# EAGLE design TLC5973 (EAGLE 6.5.0)
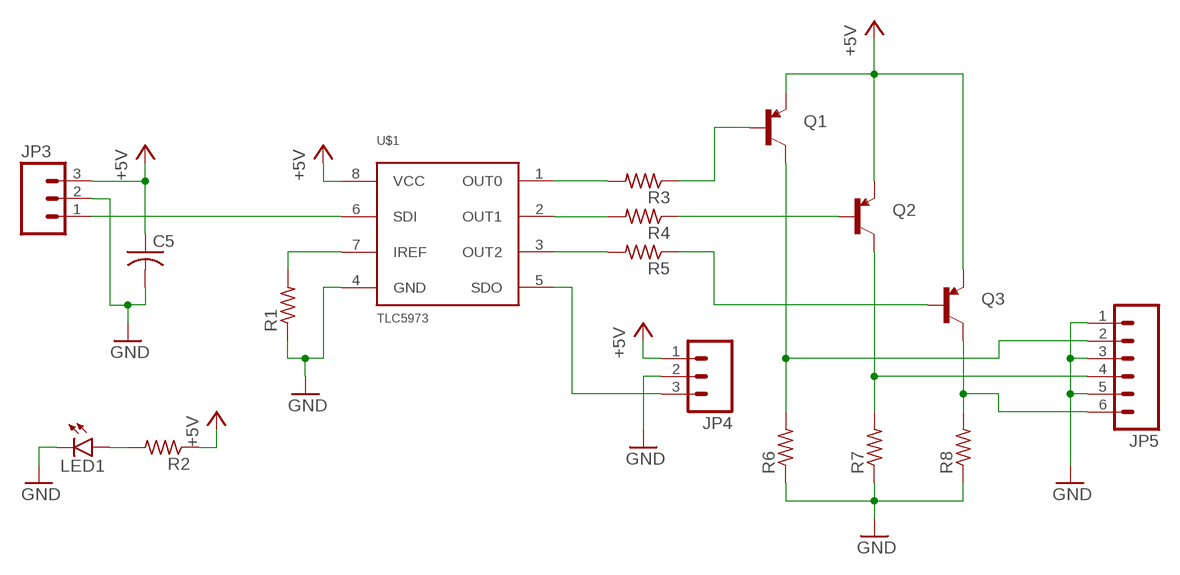
[diagram p0: schematic, sheet 1]

## Parts
C5  C-USC0805K  [C0805K]
JP3  M03LOCK  [1X03_LOCK]
JP4  M03LOCK  [1X03_LOCK]
JP5  M06LOCK  [1X06_LOCK]
LED1  LED1206  [LED-1206]
Q1  TRANSISTOR_PNPSMD  [SOT23-3]
Q2  TRANSISTOR_PNPSMD  [SOT23-3]
Q3  TRANSISTOR_PNPSMD  [SOT23-3]
R1  R-US_R0805  [R0805]
R2  R-US_R0805  [R0805]
R3  R-US_R0805  [R0805]
R4  R-US_R0805  [R0805]
R5  R-US_R0805  [R0805]
R6  R-US_R0805  [R0805]
R7  R-US_R0805  [R0805]
R8  R-US_R0805  [R0805]
U$1  TLC5973  [SO-08]

## Nets
+5V: C5.1 JP3.3 JP4.1 Q1.2(E) Q2.2(E) Q3.2(E) R2.1 U$1.8(VCC)
GND: C5.2 JP3.2 JP4.2 JP5.1 JP5.3 JP5.5 LED1.C R1.1 R6.1 R7.1 R8.1 U$1.4(GND)
N$1: R1.2 U$1.7(IREF)
N$2: JP3.1 U$1.6(SDI)
N$3: Q2.1(B) R4.1
N$4: Q1.1(B) R3.1
N$5: Q3.1(B) R5.1
N$6: JP4.3 U$1.5(SDO)
N$7: LED1.A R2.2
N$8: JP5.2 Q1.3(C) R6.2
N$10: R3.2 U$1.1(OUT0)
N$11: R4.2 U$1.2(OUT1)
N$12: R5.2 U$1.3(OUT2)
N$13: JP5.4 Q2.3(C) R7.2
N$14: JP5.6 Q3.3(C) R8.2

## Library data of the parts
C5 = rcl:C-US: CAPACITOR, American symbol
JP3 JP4 = SparkFun-Connectors:M03: Header 3 Standard 3-pin 0.1" header. Use with straight break away headers (SKU : PRT-00116), right angle break away headers (PRT-00553), swiss pins (PRT-00743), machine pins (PRT-00117), and female headers (PRT-00115). Molex polarized connector foot print use with SKU : PRT-08232 with associated crimp pins and housings.
JP5 = SparkFun-Connectors:M06: Header 6 Standard 6-pin 0.1" header. Use with straight break away headers (SKU : PRT-00116), right angle break away headers (PRT-00553), swiss pins (PRT-00743), machine pins (PRT-00117), and female headers (PRT-00115). Molex polarized connector foot print use with SKU : PRT-08094 with associated crimp pins and housings. NOTES ON THE VARIANTS LOCK and LOCK_LONGPADS... This footprint was designed to help hold the alignment of a through-hole component (i.e. 6-pin header) while soldering it into place. You may notice that each hole has been shifted either up or down by 0.005 of an inch from it's more standard position (which is a perfectly straight line). This slight alteration caused the pins (the squares in the middle) to touch the edges of the holes. Because they are alternating, it causes a "brace" to hold the component in place. 0.005 has proven to be the perfect amount of "off-center" position when using our standard breakaway headers. Although looks a little odd when you look at the bare footprint, once you have a header in there, the alteration is very hard to notice. Also,if you push a header all the way into place, it is covered up entirely on the bottom side. This idea of altering the position of holes to aid alignment will be further integrated into the Sparkfun Library for other footprints. It can help hold any component with 3 or more connection pins.
LED1 = SparkFun-LED:LED: LEDs Standard schematic elements and footprints for 5mm, 3mm, 1206, and 0603 sized LEDs. 5mm - Spark Fun Electronics SKU : COM-00529 (and others)
Q1-Q3 = SparkFun-DiscreteSemi:TRANSISTOR_PNP: Generic PNP BJT Double check pinouts against datasheets- not all devices are the same! MMBT3906 - 40V 200mA SOT-23 (TRANS-08052) MMBT4403 - 40V 600mA SOT-23 (TRANS-09245)
R1-R8 = rcl:R-US_: RESISTOR, American symbol
U$1 = texas:TLC5973: TLC5973 3-channel 12-bit PWM LED driver. 2-50mA, internal 12MHz GS clock, 2.9KHz PWM frequency. SOIC-8 package

## Board
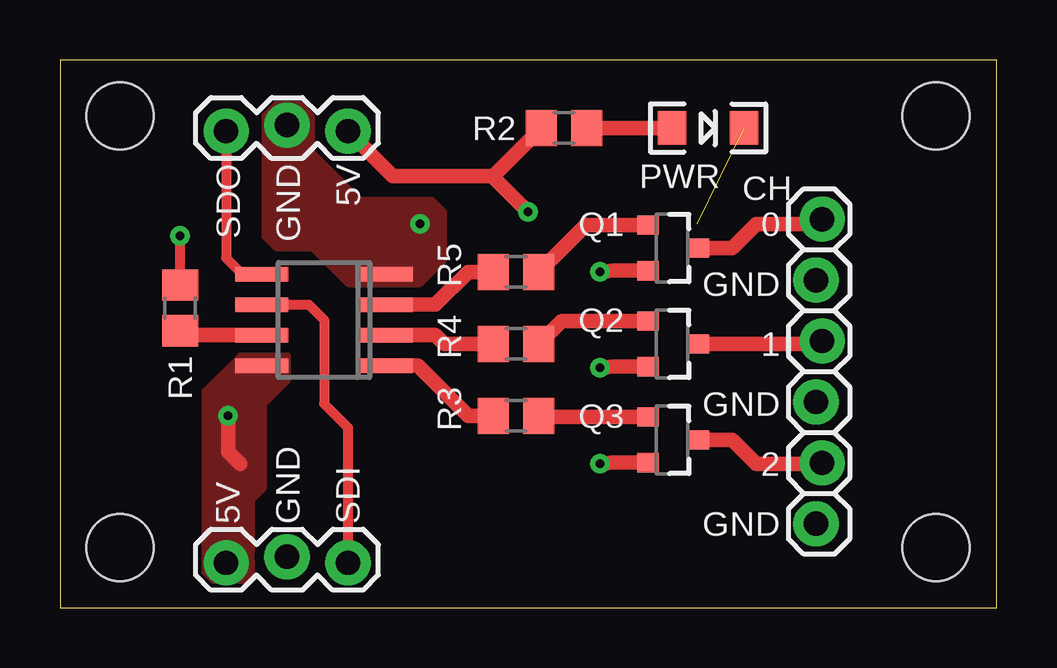
[diagram p1: board, top side]
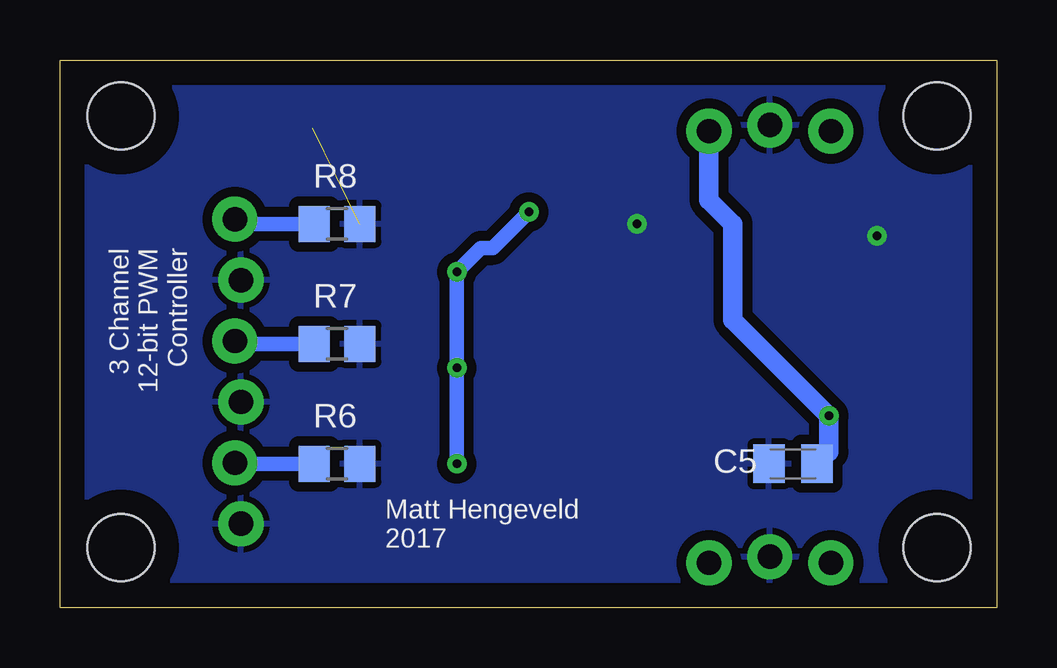
[diagram p2: board, bottom side, seen from below]

Size 39.04 x 22.84 mm. Coordinates in mm from the lower left corner, seen from the top.
Outline: 0,0 39.04,0 39.04,22.84 0,22.84 0,0
Copper layers (1*16): Top 0.035mm / dielectric 1.5mm / Bottom 0.035mm
Design rules "default": minimum track width 10mil, minimum drill 24mil, track to track 8mil, track to pad 8mil, pad to pad 8mil, via to via 8mil, smd to smd 8mil, copper to edge 40mil, drill to drill 8mil, minimum pad ring 10mil, minimum via ring 8mil, stop-mask expansion 4mil, vias tented up to drill 0mil, thermal gap 10mil
Holes 2.8 mm at 2.5,20.5 2.5,2.5 36.5,2.5 36.5,20.5

### Footprints (pad centres in the part's own frame; a part is rotated, then mirrored left to right if it is on the bottom)
C0805K = smd 1.3 x 1.6: 1 -1,0; 2 1,0
1X03_LOCK = drill 1.016 pad 1.88: 1 0,0.127; 2 2.54,-0.127; 3 5.08,0.127
1X06_LOCK = drill 1.016 pad 1.88: 1 0,0; 2 2.54,-0.254; 3 5.08,0; 4 7.62,-0.254; 5 10.16,0; 6 12.7,-0.254
LED-1206 = smd 1.2 x 1.4: A -1.5,0; C 1.5,0
SOT23-3 = smd 0.8 x 0.9: 1 -0.95,-1; 2 0.95,-1; 3 0,1.1
R0805 = smd 1.3 x 1.5: 1 -0.95,0; 2 0.95,0
SO-08 = smd 0.6 x 2.2: 1 -1.905,-2.6; 2 -0.635,-2.6; 3 0.635,-2.6; 4 1.905,-2.6; 5 1.905,2.6; 6 0.635,2.6; 7 -0.635,2.6; 8 -1.905,2.6

### Placement (x,y rotation side)
C5  8.5,6 180 bottom
JP3  12,2 180 top
JP4  12,20 180 top
JP5  31.5,3.5 90 top
LED1  27,20 0 top
Q1  25.5,7 270 top
Q2  25.5,11 270 top
Q3  25.5,15 270 top
R1  5,12.5 270 top
R2  21,20 0 top
R3  19,8 180 top
R4  19,11 180 top
R5  19,14 180 top
R6  27.5,6 180 bottom
R7  27.5,11 180 bottom
R8  27.5,16 180 bottom
U$1  11,12 90 top

### Tracks (layer width: path | path; a pad name or v marks a point on that pad's centre or on a via)
+5V  (via drill 0.35 pad 0.81)
  Top 0.61: v19.5,16.5 18,18 | 18,18 13.87,18 JP4.1 | Q3.2 23.05,14.05 v22.5,14 | Q2.2 23.05,10.05 v22.5,10 | Q1.2 23.05,6.05 v22.5,6 | v7,8 7,6.5 C5.1 | 18,18 18.05,18 R2.1
  Bottom 0.61: v22.5,6 v22.5,10 v22.5,14 21.5,15 21,15 v19.5,16.5
  Bottom 0.813: JP4.1 12,17 11,16 11,12 v7,8 7,6.5 C5.1
  pour Top (isolate 0.406, no thermals): 9.5,10.5 7.5,10.5 6,9 6,1.5 6.5,1 7.5,1 8,1.5 8,4.5 8.5,5 8.5,8.5 9.5,9.5
GND  (via drill 0.35 pad 0.81)  (1 unrouted)
  Top 0.406: R1.1 v5,15.5
  other vias: 15,16
  pour Bottom (isolate 0.406): 36,22 3,22 1,20 1,3 3,1 36,1 38,3 38,20
  pour Top (isolate 0.406, no thermals): 12,13.5 15,13.5 16,14.5 16,16.5 15.5,17 12.5,17 10.5,19 10.5,20.5 10,21 9,21 8.5,20.5 8.5,15.5 9,15 10.5,15
N$1
  Top 0.61: U$1.7 5.18,11.37 R1.2
N$2
  Top 0.406: U$1.6 10.37,12.63 11,12 11,8.5 12,7.5 JP3.1
N$3
  Top 0.61: Q2.1 20.9,11.95 R4.1
N$4
  Top 0.61: Q1.1 20,7.95 R3.1
N$5
  Top 0.61: Q3.1 21.9,15.95 R5.1
N$6
  Top 0.406: U$1.5 7.59,13.9 6.92,14.58 JP4.3
N$7
  Top 0.61: R2.2 LED1.A
N$8
  Top 0.61: Q1.3 28,7 29,6 31.71,6 JP5.2
  Bottom 0.61: R6.2 31.71,6 JP5.2
N$10
  Top 0.61: U$1.1 14.9,10.1 17,8 R3.2
N$11
  Top 0.61: U$1.2 15.63,11.37 16,11 R4.2
N$12
  Top 0.61: U$1.3 15.63,12.63 17,14 R5.2
N$13
  Top 0.61: Q2.3 31.63,11 JP5.4
  Bottom 0.61: R7.2 31.63,11 JP5.4
N$14
  Top 0.61: Q3.3 28,15 29,16 31.55,16 JP5.6
  Bottom 0.61: R8.2 31.55,16 JP5.6

### Text on the board
tPlace: SDO | GND | 5V | PWR | CH | Q1 | 0 | GND | Q2 | 1 | GND | Q3 | 2 | 5V | GND | SDI | GND
bPlace: 3 Channel / 12-bit PWM / Controller | Matt Hengeveld / 2017